# Altium schematic sheet AVALON_hashunit_chip.SchDoc
size A1
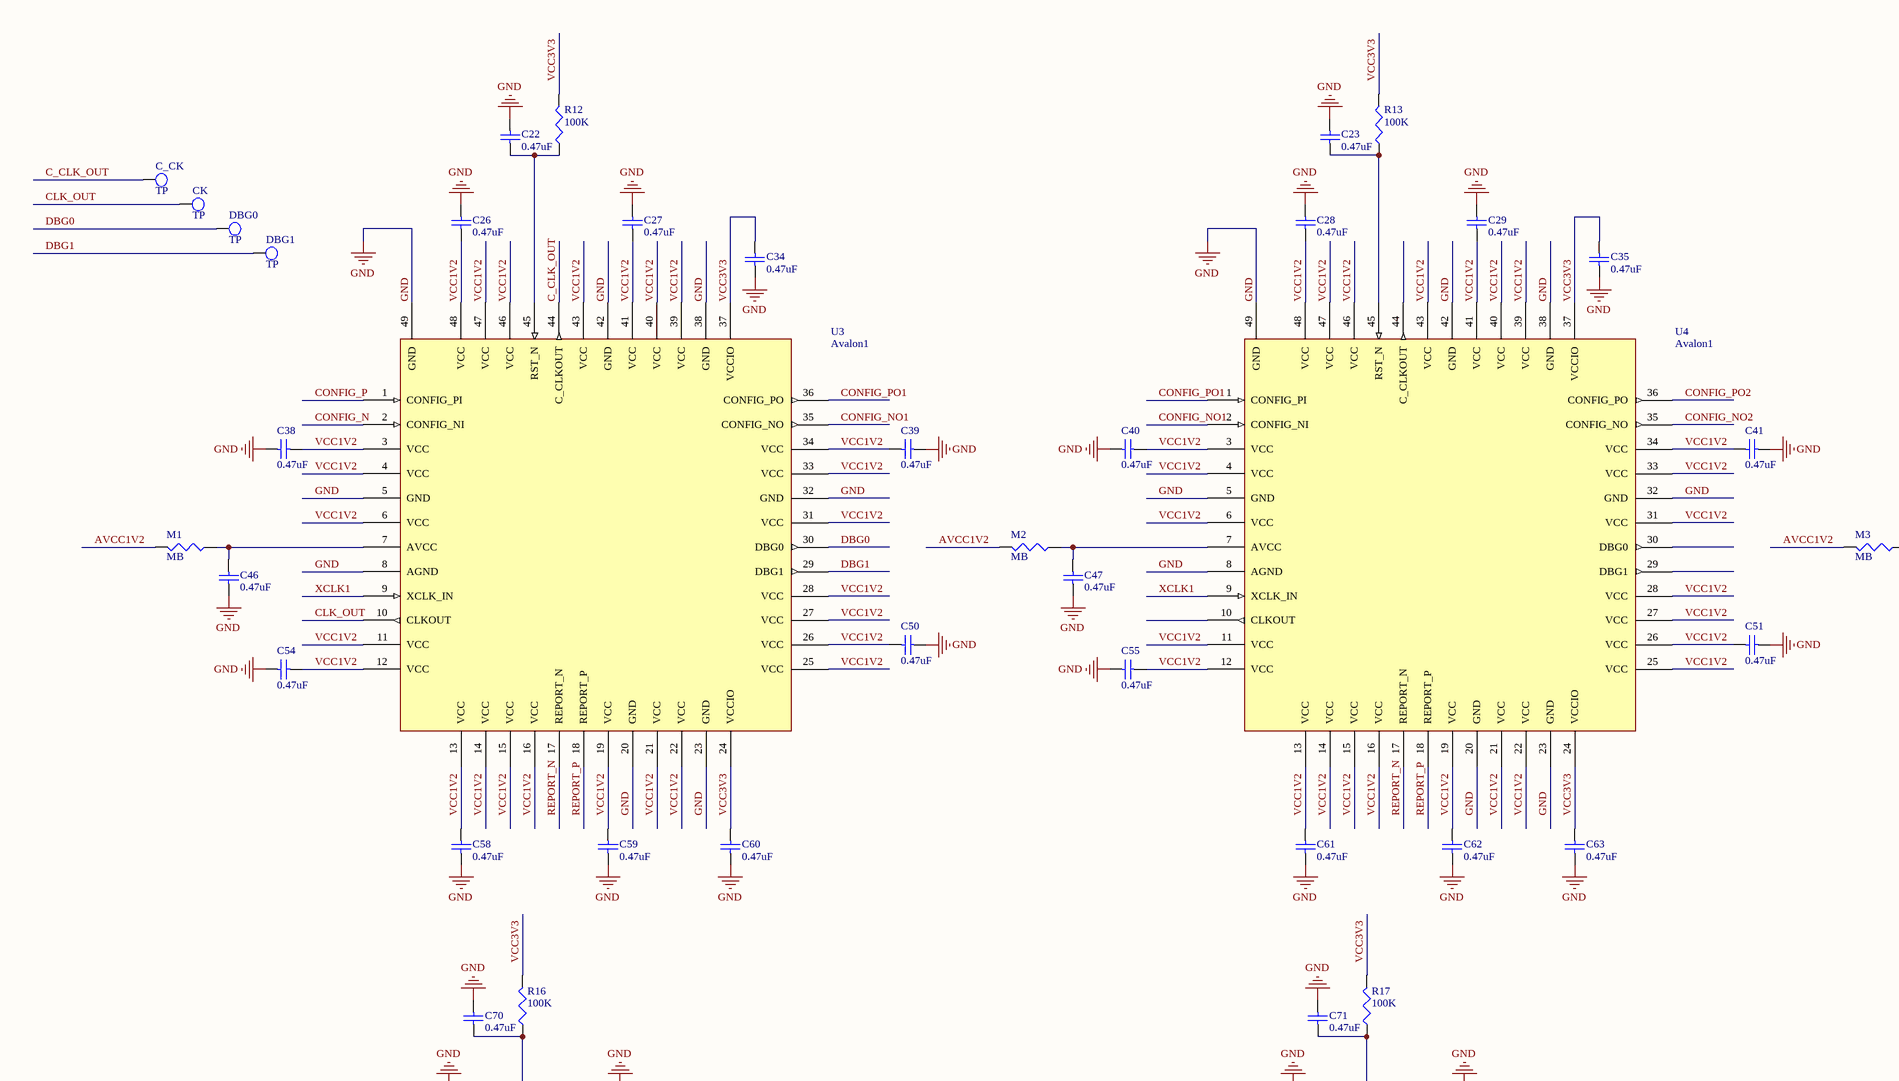
[diagram p0: AVALON_hashunit_chip.SchDoc, top left]
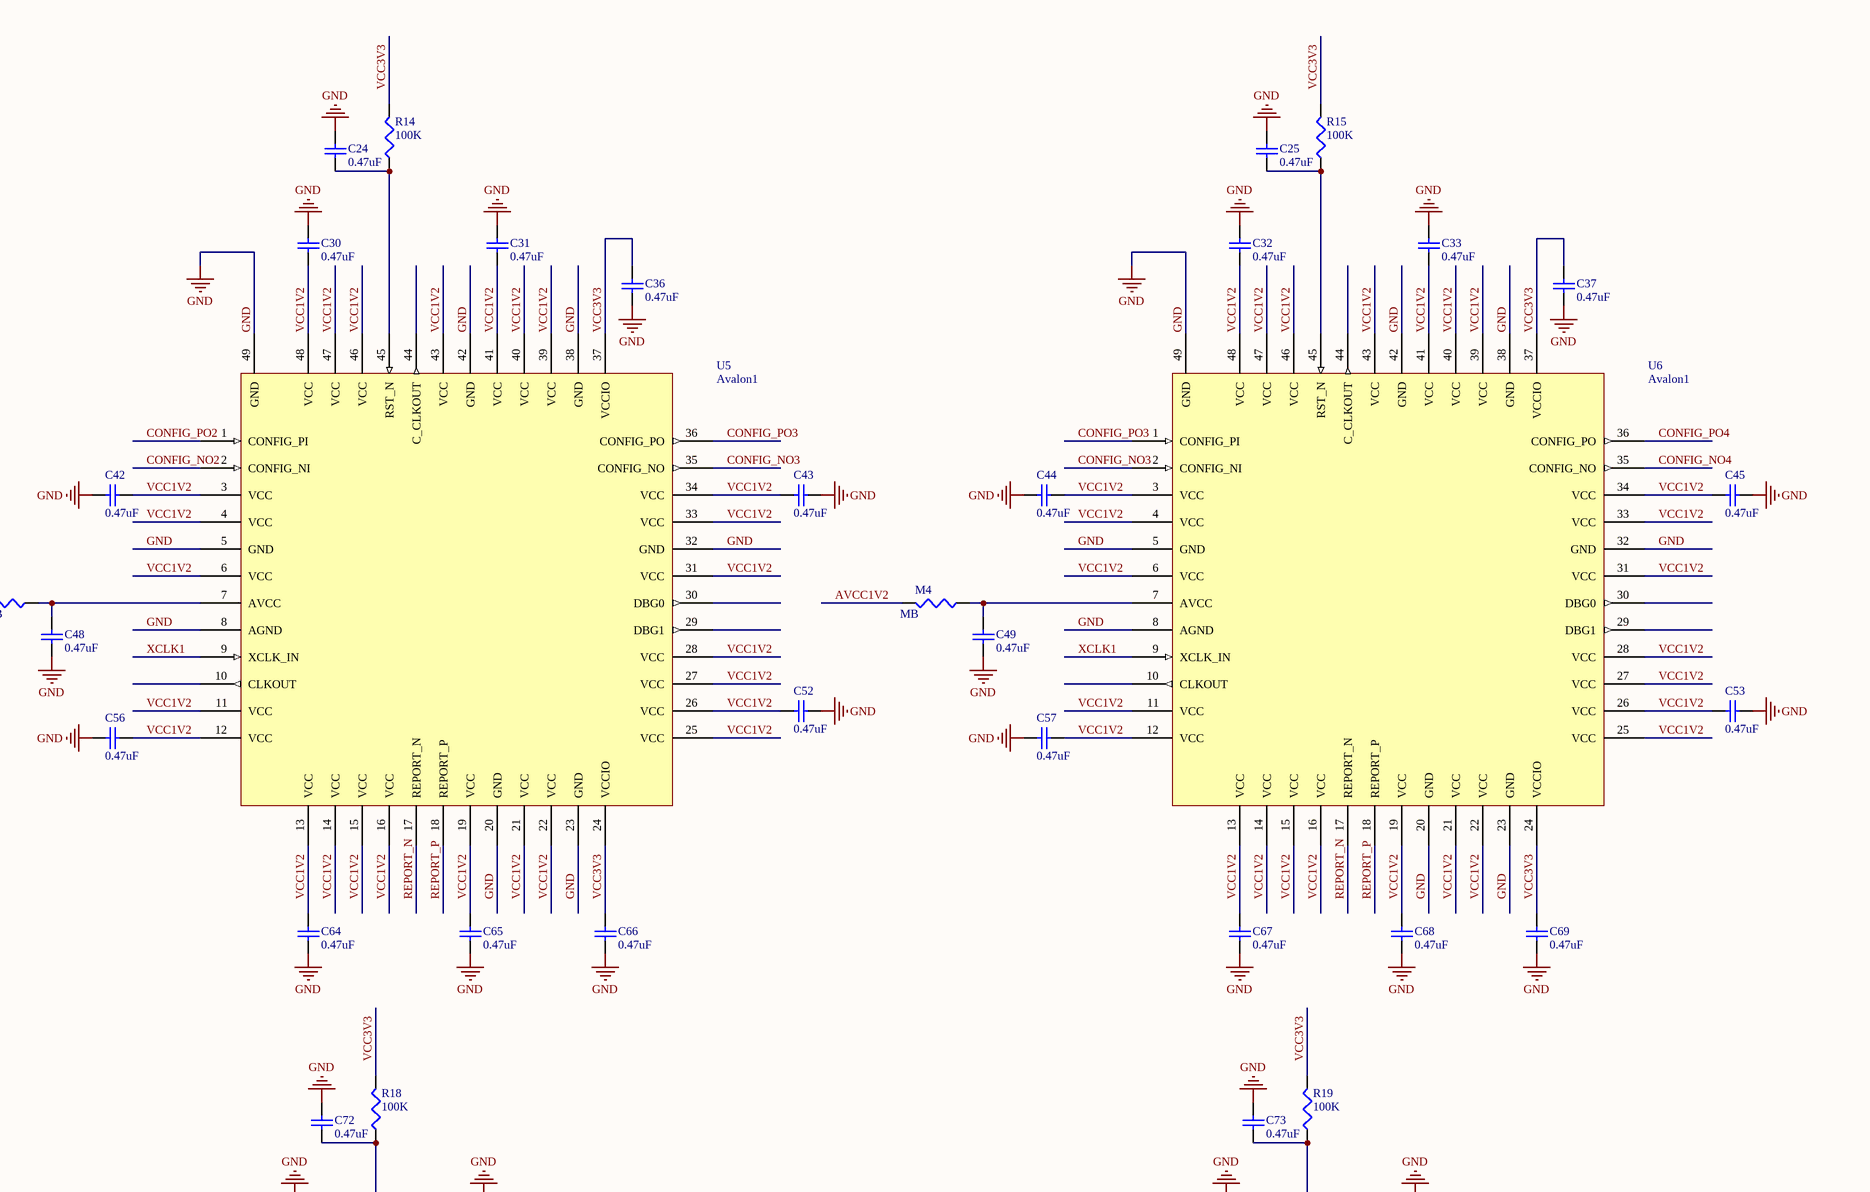
[diagram p1: AVALON_hashunit_chip.SchDoc, top right]
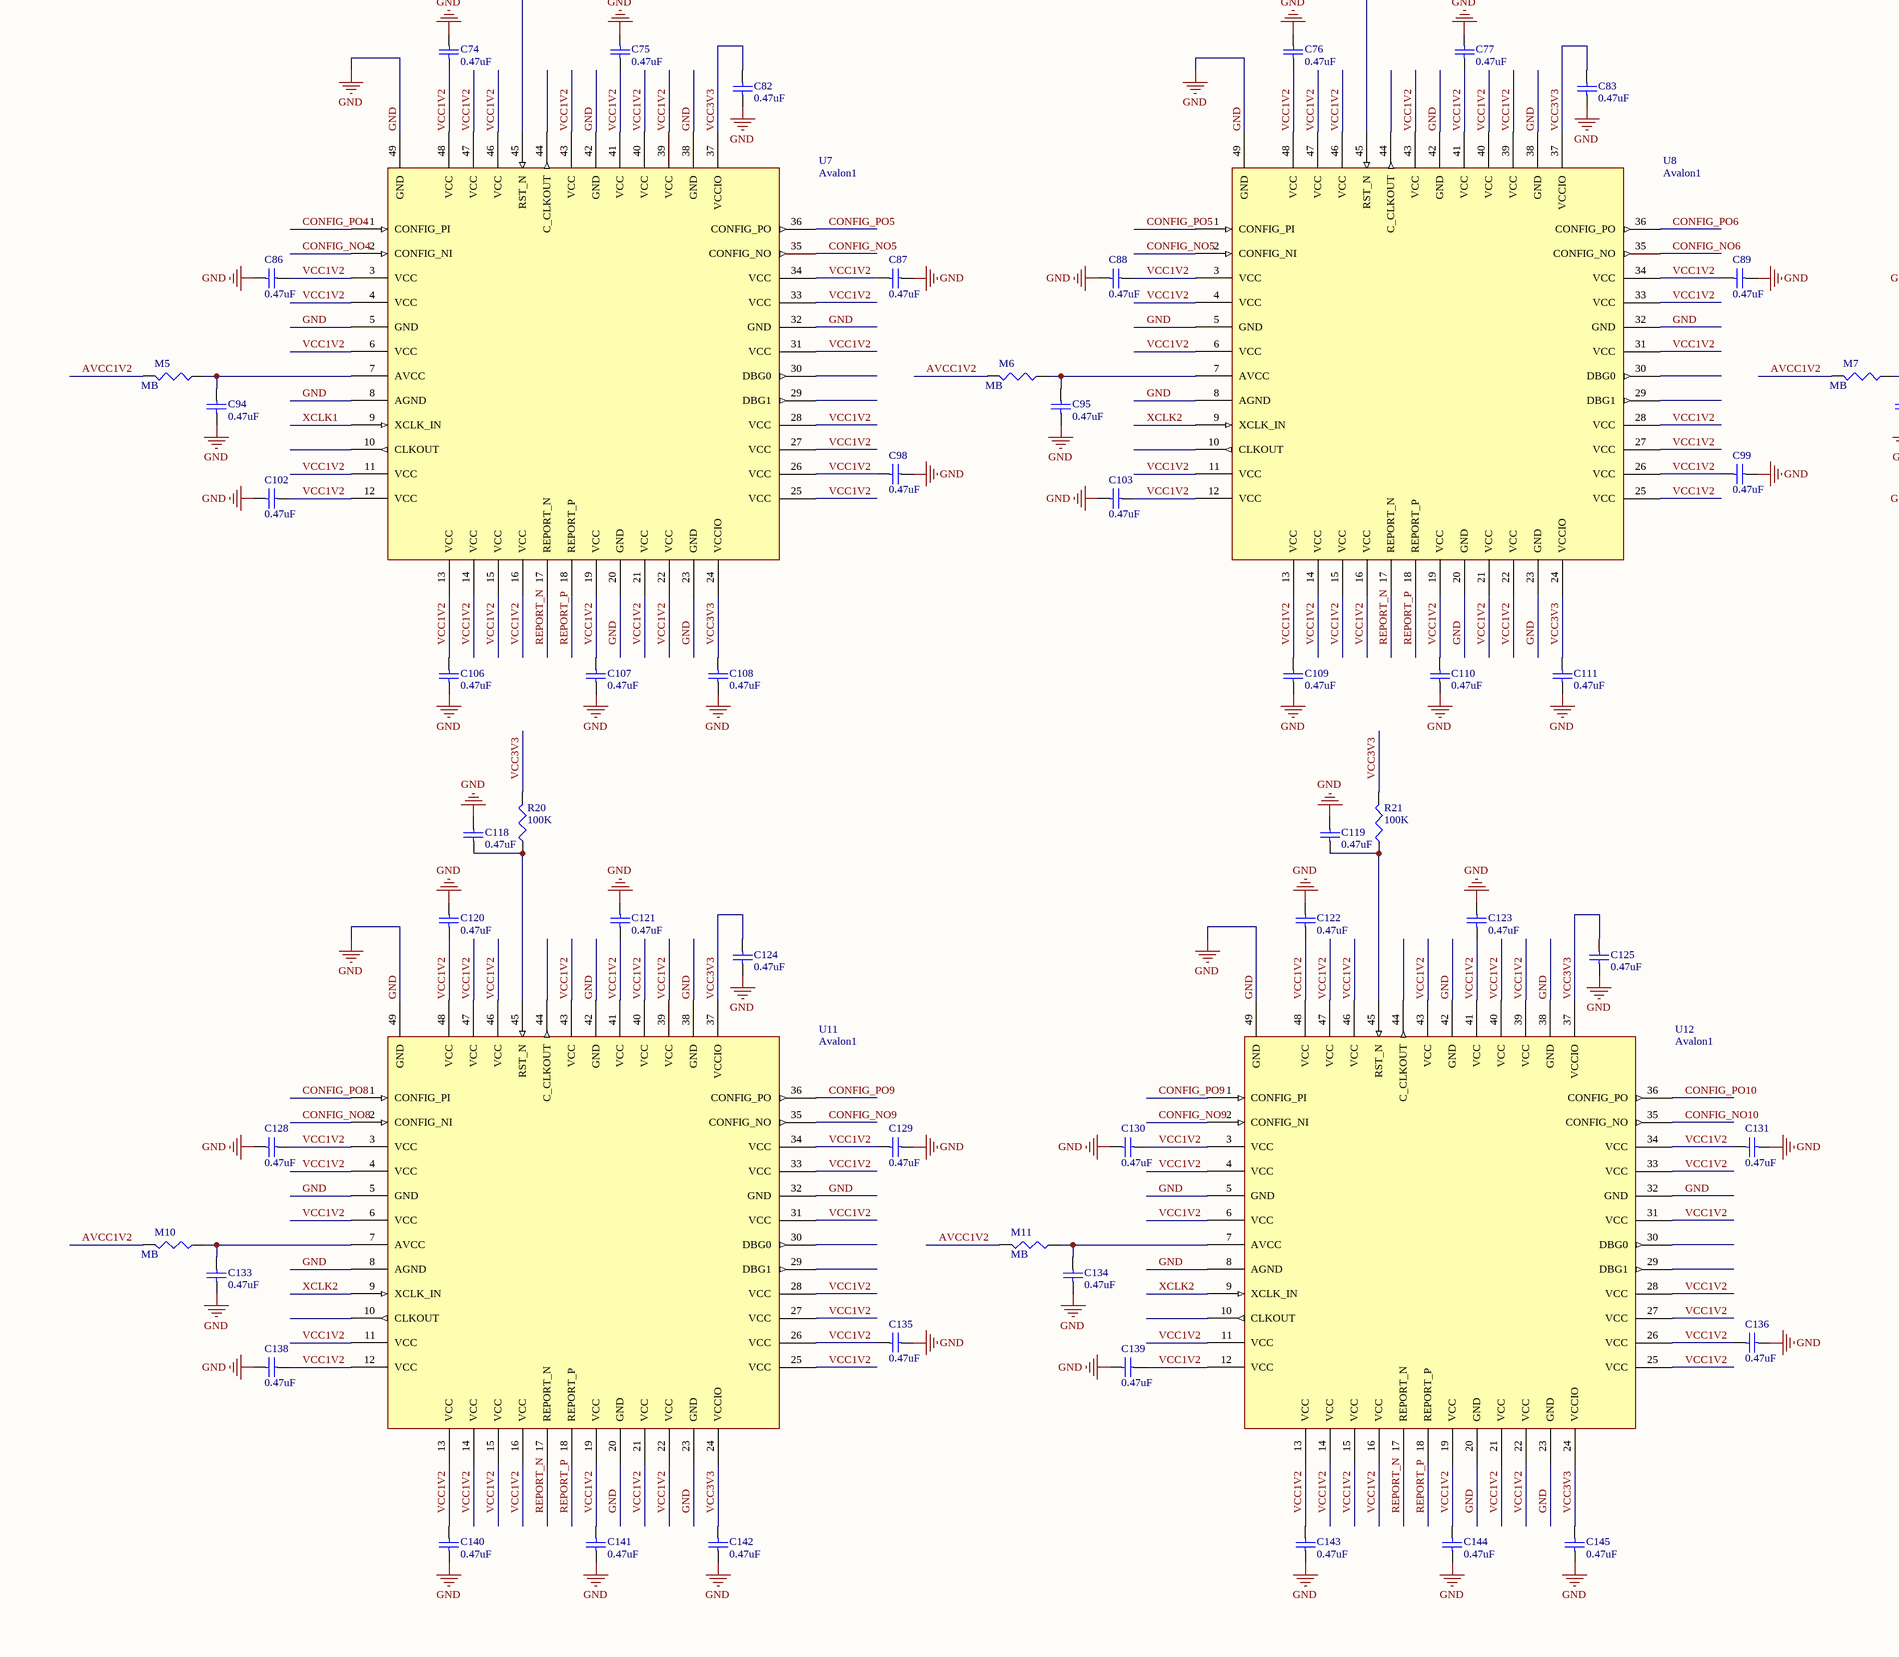
[diagram p2: AVALON_hashunit_chip.SchDoc, bottom left]
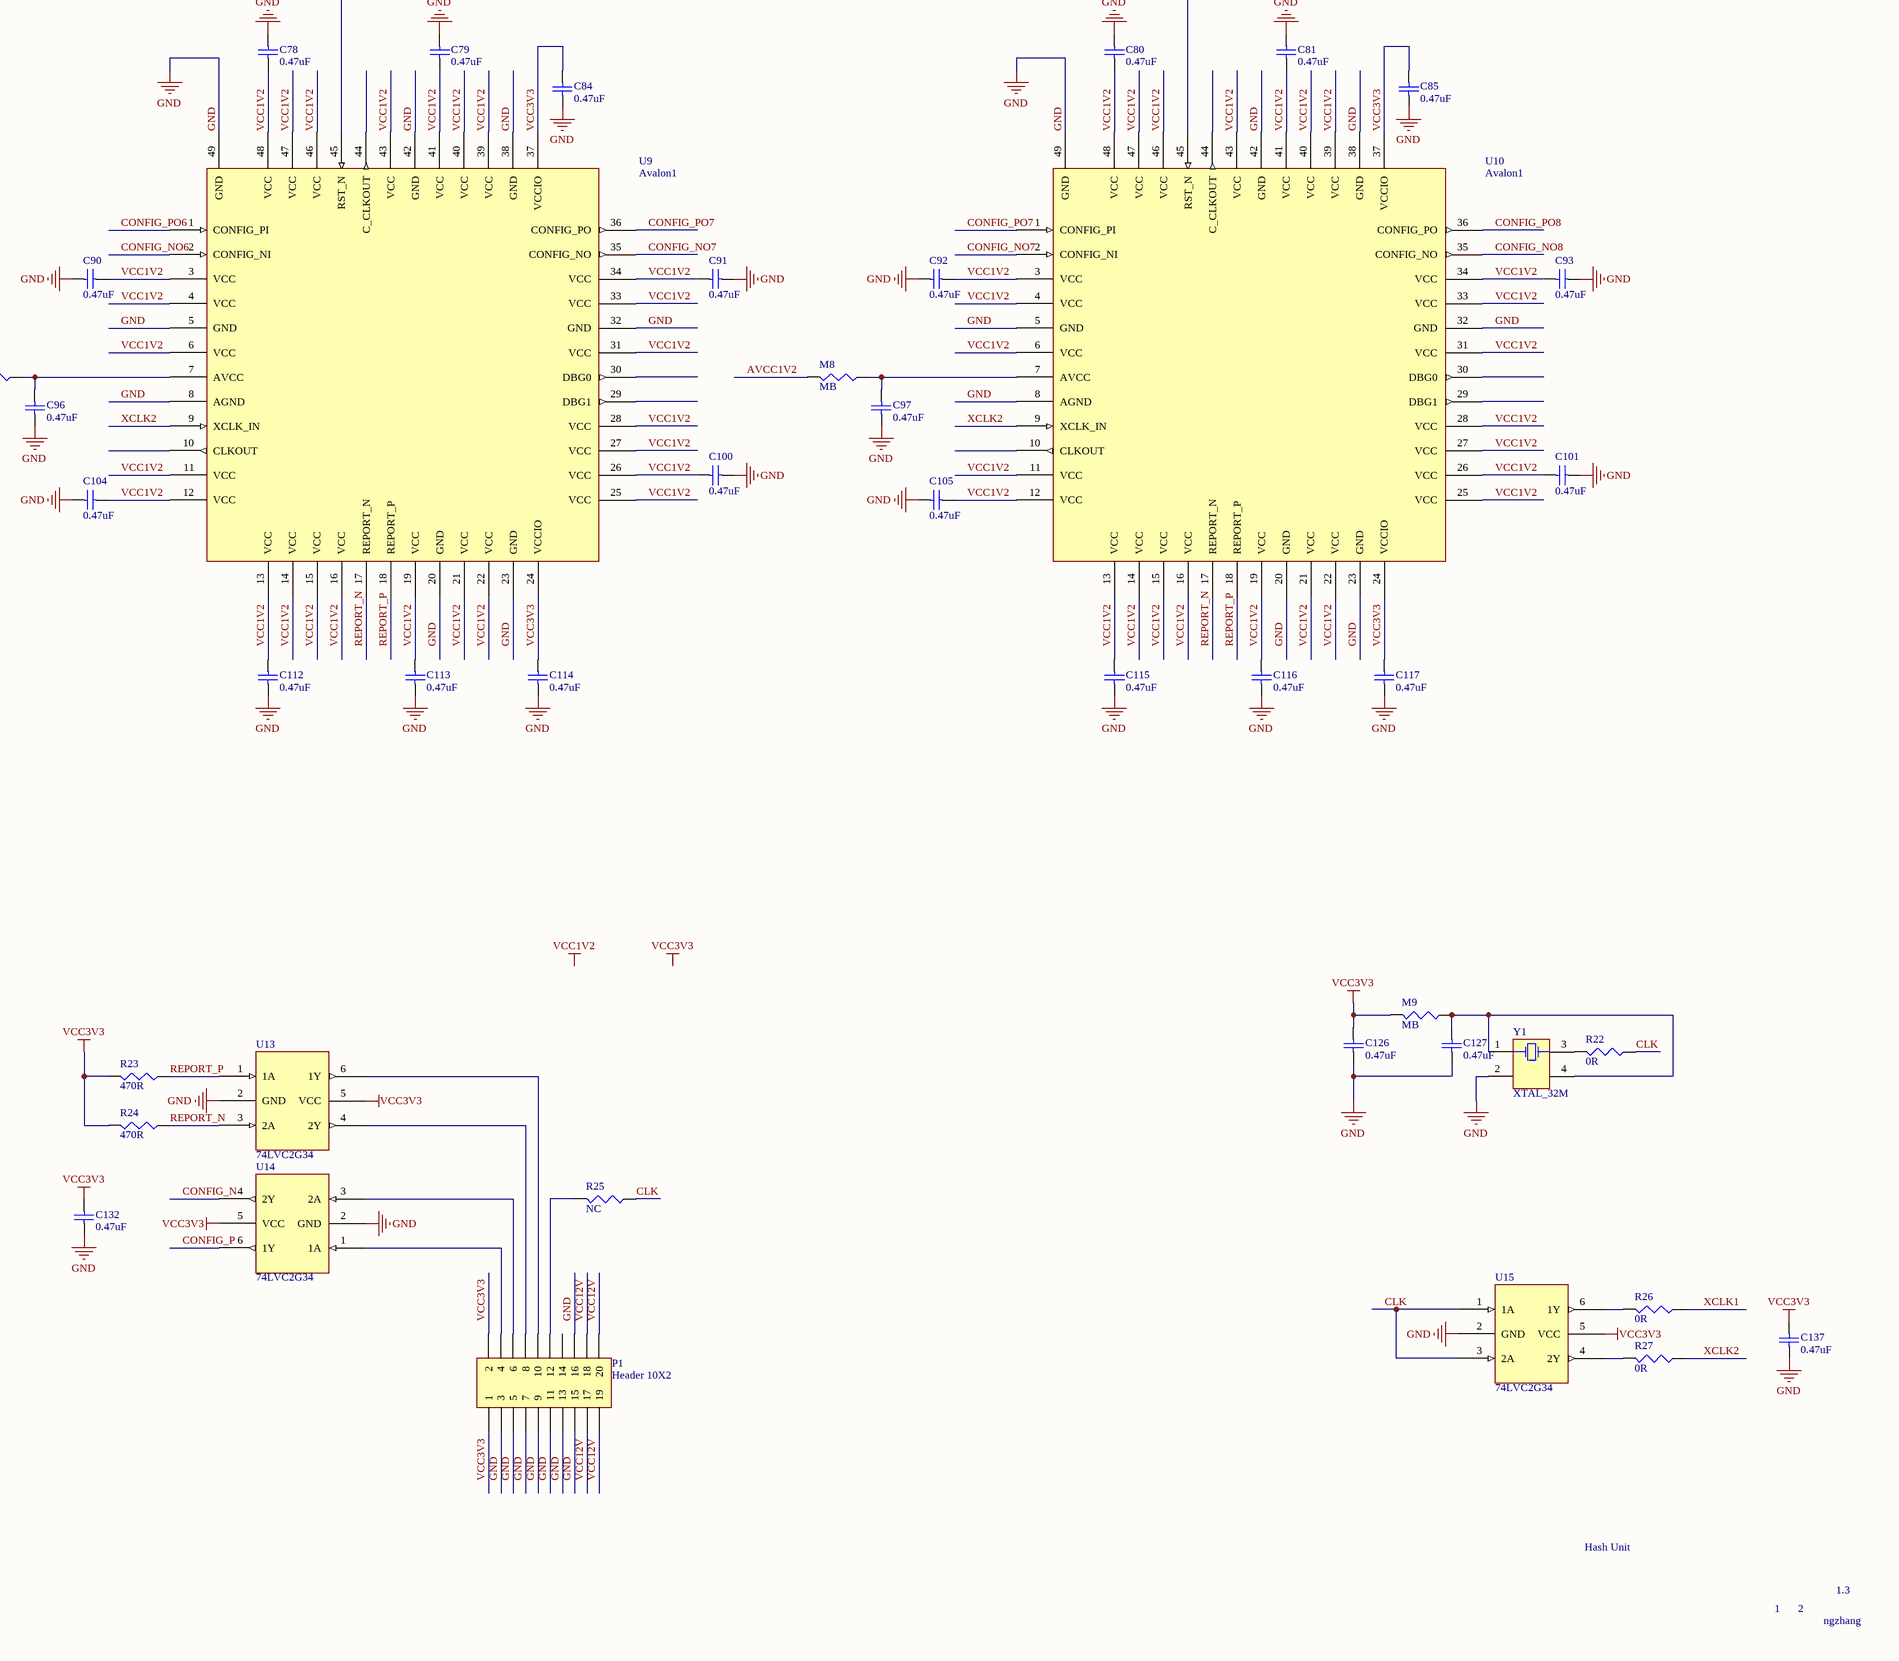
[diagram p3: AVALON_hashunit_chip.SchDoc, bottom right]

## Parts
C22  0.47uF  [CAPC1005L]
C23  0.47uF  [CAPC1005L]
C24  0.47uF  [CAPC1005L]
C25  0.47uF  [CAPC1005L]
C26  0.47uF  [CAPC1005L]
C27  0.47uF  [CAPC1005L]
C28  0.47uF  [CAPC1005L]
C29  0.47uF  [CAPC1005L]
C30  0.47uF  [CAPC1005L]
C31  0.47uF  [CAPC1005L]
C32  0.47uF  [CAPC1005L]
C33  0.47uF  [CAPC1005L]
C34  0.47uF  [CAPC1005L]
C35  0.47uF  [CAPC1005L]
C36  0.47uF  [CAPC1005L]
C37  0.47uF  [CAPC1005L]
C38  0.47uF  [CAPC1005L]
C39  0.47uF  [CAPC1005L]
C40  0.47uF  [CAPC1005L]
C41  0.47uF  [CAPC1005L]
C42  0.47uF  [CAPC1005L]
C43  0.47uF  [CAPC1005L]
C44  0.47uF  [CAPC1005L]
C45  0.47uF  [CAPC1005L]
C46  0.47uF  [CAPC1005L]
C47  0.47uF  [CAPC1005L]
C48  0.47uF  [CAPC1005L]
C49  0.47uF  [CAPC1005L]
C50  0.47uF  [CAPC1005L]
C51  0.47uF  [CAPC1005L]
C52  0.47uF  [CAPC1005L]
C53  0.47uF  [CAPC1005L]
C54  0.47uF  [CAPC1005L]
C55  0.47uF  [CAPC1005L]
C56  0.47uF  [CAPC1005L]
C57  0.47uF  [CAPC1005L]
C58  0.47uF  [CAPC1005L]
C59  0.47uF  [CAPC1005L]
C60  0.47uF  [CAPC1005L]
C61  0.47uF  [CAPC1005L]
C62  0.47uF  [CAPC1005L]
C63  0.47uF  [CAPC1005L]
C64  0.47uF  [CAPC1005L]
C65  0.47uF  [CAPC1005L]
C66  0.47uF  [CAPC1005L]
C67  0.47uF  [CAPC1005L]
C68  0.47uF  [CAPC1005L]
C69  0.47uF  [CAPC1005L]
C70  0.47uF  [CAPC1005L]
C71  0.47uF  [CAPC1005L]
C72  0.47uF  [CAPC1005L]
C73  0.47uF  [CAPC1005L]
C74  0.47uF  [CAPC1005L]
C75  0.47uF  [CAPC1005L]
C76  0.47uF  [CAPC1005L]
C77  0.47uF  [CAPC1005L]
C78  0.47uF  [CAPC1005L]
C79  0.47uF  [CAPC1005L]
C80  0.47uF  [CAPC1005L]
C81  0.47uF  [CAPC1005L]
C82  0.47uF  [CAPC1005L]
C83  0.47uF  [CAPC1005L]
C84  0.47uF  [CAPC1005L]
C85  0.47uF  [CAPC1005L]
C86  0.47uF  [CAPC1005L]
C87  0.47uF  [CAPC1005L]
C88  0.47uF  [CAPC1005L]
C89  0.47uF  [CAPC1005L]
C90  0.47uF  [CAPC1005L]
C91  0.47uF  [CAPC1005L]
C92  0.47uF  [CAPC1005L]
C93  0.47uF  [CAPC1005L]
C94  0.47uF  [CAPC1005L]
C95  0.47uF  [CAPC1005L]
C96  0.47uF  [CAPC1005L]
C97  0.47uF  [CAPC1005L]
C98  0.47uF  [CAPC1005L]
C99  0.47uF  [CAPC1005L]
C100  0.47uF  [CAPC1005L]
C101  0.47uF  [CAPC1005L]
C102  0.47uF  [CAPC1005L]
C103  0.47uF  [CAPC1005L]
C104  0.47uF  [CAPC1005L]
C105  0.47uF  [CAPC1005L]
C106  0.47uF  [CAPC1005L]
C107  0.47uF  [CAPC1005L]
C108  0.47uF  [CAPC1005L]
C109  0.47uF  [CAPC1005L]
C110  0.47uF  [CAPC1005L]
C111  0.47uF  [CAPC1005L]
C112  0.47uF  [CAPC1005L]
C113  0.47uF  [CAPC1005L]
C114  0.47uF  [CAPC1005L]
C115  0.47uF  [CAPC1005L]
C116  0.47uF  [CAPC1005L]
C117  0.47uF  [CAPC1005L]
C118  0.47uF  [CAPC1005L]
C119  0.47uF  [CAPC1005L]
C120  0.47uF  [CAPC1005L]
C121  0.47uF  [CAPC1005L]
C122  0.47uF  [CAPC1005L]
C123  0.47uF  [CAPC1005L]
C124  0.47uF  [CAPC1005L]
C125  0.47uF  [CAPC1005L]
C126  0.47uF  [CAPC1005L]
C127  0.47uF  [CAPC1005L]
C128  0.47uF  [CAPC1005L]
C129  0.47uF  [CAPC1005L]
C130  0.47uF  [CAPC1005L]
C131  0.47uF  [CAPC1005L]
C132  0.47uF  [CAPC1005L]
C133  0.47uF  [CAPC1005L]
C134  0.47uF  [CAPC1005L]
C135  0.47uF  [CAPC1005L]
C136  0.47uF  [CAPC1005L]
C137  0.47uF  [CAPC1005L]
C138  0.47uF  [CAPC1005L]
C139  0.47uF  [CAPC1005L]
C140  0.47uF  [CAPC1005L]
C141  0.47uF  [CAPC1005L]
C142  0.47uF  [CAPC1005L]
C143  0.47uF  [CAPC1005L]
C144  0.47uF  [CAPC1005L]
C145  0.47uF  [CAPC1005L]
C_CK  TP  [TP]
CK  TP  [TP]
DBG0  TP  [TP]
DBG1  TP  [TP]
M1  MB  [RESC1005L]
M2  MB  [RESC1005L]
M3  MB  [RESC1005L]
M4  MB  [RESC1005L]
M5  MB  [RESC1005L]
M6  MB  [RESC1005L]
M7  MB  [RESC1005L]
M8  MB  [RESC1005L]
M9  MB  [RESC1005L]
M10  MB  [RESC1005L]
M11  MB  [RESC1005L]
P1  Header 10X2  [20PINSMT]
R12  100K  [RESC1005L]
R13  100K  [RESC1005L]
R14  100K  [RESC1005L]
R15  100K  [RESC1005L]
R16  100K  [RESC1005L]
R17  100K  [RESC1005L]
R18  100K  [RESC1005L]
R19  100K  [RESC1005L]
R20  100K  [RESC1005L]
R21  100K  [RESC1005L]
R22  0R  [RESC1005L]
R23  470R  [RESC1005L]
R24  470R  [RESC1005L]
R25  NC  [RESC1005L]
R26  0R  [RESC1005L]
R27  0R  [RESC1005L]
U3  Avalon1  [QFN48NT7A]
U4  Avalon1  [QFN48NT7A]
U5  Avalon1  [QFN48NT7A]
U6  Avalon1  [QFN48NT7A]
U7  Avalon1  [QFN48NT7A]
U8  Avalon1  [QFN48NT7A]
U9  Avalon1  [QFN48NT7A]
U10  Avalon1  [QFN48NT7A]
U11  Avalon1  [QFN48NT7A]
U12  Avalon1  [QFN48NT7A]
U13  74LVC2G34  [SOT363_L]
U14  74LVC2G34  [SOT363_L]
U15  74LVC2G34  [SOT363_L]
Y1  XTAL_32M  [SMX2]

## Nets
GND: C22.2 C23.2 C24.2 C25.2 C26.2 C27.1 C28.2 C29.1 C30.2 C31.1 C32.2 C33.1 C34.1 C35.1 C36.1 C37.1 C38.2 C39.1 C40.2 C41.1 C42.2 C43.1 C44.2 C45.1 C46.2 C47.2 C48.2 C49.2 C50.1 C51.1 C52.1 C53.1 C54.2 C55.2 C56.2 C57.2 C58.1 C59.1 C60.1 C61.1 C62.1 C63.1 C64.1 C65.1 C66.1 C67.1 C68.1 C69.1 C70.2 C71.2 C72.2 C73.2 C74.2 C75.1 C76.2 C77.1 C78.2 C79.1 C80.2 C81.1 C82.1 C83.1 C84.1 C85.1 C86.2 C87.1 C88.2 C89.1 C90.2 C91.1 C92.2 C93.1 C94.2 C95.2 C96.2 C97.2 C98.1 C99.1 C100.1 C101.1 C102.2 C103.2 C104.2 C105.2 C106.1 C107.1 C108.1 C109.1 C110.1 C111.1 C112.1 C113.1 C114.1 C115.1 C116.1 C117.1 C118.2 C119.2 C120.2 C121.1 C122.2 C123.1 C124.1 C125.1 C126.1 C127.1 C128.2 C129.1 C130.2 C131.1 C132.2 C133.2 C134.2 C135.1 C136.1 C137.2 C138.2 C139.2 C140.1 C141.1 C142.1 C143.1 C144.1 C145.1 P1.3 P1.5 P1.7 P1.9 P1.11 P1.13 P1.15 P1.16 U3.5(GND) U3.8(AGND) U3.20(GND) U3.23(GND) U3.32(GND) U3.38(GND) U3.42(GND) U3.49(GND) U4.5(GND) U4.8(AGND) U4.20(GND) U4.23(GND) U4.32(GND) U4.38(GND) U4.42(GND) U4.49(GND) U5.5(GND) U5.8(AGND) U5.20(GND) U5.23(GND) U5.32(GND) U5.38(GND) U5.42(GND) U5.49(GND) U6.5(GND) U6.8(AGND) U6.20(GND) U6.23(GND) U6.32(GND) U6.38(GND) U6.42(GND) U6.49(GND) U7.5(GND) U7.8(AGND) U7.20(GND) U7.23(GND) U7.32(GND) U7.38(GND) U7.42(GND) U7.49(GND) U8.5(GND) U8.8(AGND) U8.20(GND) U8.23(GND) U8.32(GND) U8.38(GND) U8.42(GND) U8.49(GND) U9.5(GND) U9.8(AGND) U9.20(GND) U9.23(GND) U9.32(GND) U9.38(GND) U9.42(GND) U9.49(GND) U10.5(GND) U10.8(AGND) U10.20(GND) U10.23(GND) U10.32(GND) U10.38(GND) U10.42(GND) U10.49(GND) U11.5(GND) U11.8(AGND) U11.20(GND) U11.23(GND) U11.32(GND) U11.38(GND) U11.42(GND) U11.49(GND) U12.5(GND) U12.8(AGND) U12.20(GND) U12.23(GND) U12.32(GND) U12.38(GND) U12.42(GND) U12.49(GND) U13.2(GND) U14.2(GND) U15.2(GND) Y1.2(NC)
VCC1V2: C26.1 C27.2 C28.1 C29.2 C30.1 C31.2 C32.1 C33.2 C38.1 C39.2 C40.1 C41.2 C42.1 C43.2 C44.1 C45.2 C50.2 C51.2 C52.2 C53.2 C54.1 C55.1 C56.1 C57.1 C58.2 C59.2 C61.2 C62.2 C64.2 C65.2 C67.2 C68.2 C74.1 C75.2 C76.1 C77.2 C78.1 C79.2 C80.1 C81.2 C86.1 C87.2 C88.1 C89.2 C90.1 C91.2 C92.1 C93.2 C98.2 C99.2 C100.2 C101.2 C102.1 C103.1 C104.1 C105.1 C106.2 C107.2 C109.2 C110.2 C112.2 C113.2 C115.2 C116.2 C120.1 C121.2 C122.1 C123.2 C128.1 C129.2 C130.1 C131.2 C135.2 C136.2 C138.1 C139.1 C140.2 C141.2 C143.2 C144.2 U3.3(VCC) U3.4(VCC) U3.6(VCC) U3.11(VCC) U3.12(VCC) U3.13(VCC) U3.14(VCC) U3.15(VCC) U3.16(VCC) U3.19(VCC) U3.21(VCC) U3.22(VCC) U3.25(VCC) U3.26(VCC) U3.27(VCC) U3.28(VCC) U3.31(VCC) U3.33(VCC) U3.34(VCC) U3.39(VCC) U3.40(VCC) U3.41(VCC) U3.43(VCC) U3.46(VCC) U3.47(VCC) U3.48(VCC) U4.3(VCC) U4.4(VCC) U4.6(VCC) U4.11(VCC) U4.12(VCC) U4.13(VCC) U4.14(VCC) U4.15(VCC) U4.16(VCC) U4.19(VCC) U4.21(VCC) U4.22(VCC) U4.25(VCC) U4.26(VCC) U4.27(VCC) U4.28(VCC) U4.31(VCC) U4.33(VCC) U4.34(VCC) U4.39(VCC) U4.40(VCC) U4.41(VCC) U4.43(VCC) U4.46(VCC) U4.47(VCC) U4.48(VCC) U5.3(VCC) U5.4(VCC) U5.6(VCC) U5.11(VCC) U5.12(VCC) U5.13(VCC) U5.14(VCC) U5.15(VCC) U5.16(VCC) U5.19(VCC) U5.21(VCC) U5.22(VCC) U5.25(VCC) U5.26(VCC) U5.27(VCC) U5.28(VCC) U5.31(VCC) U5.33(VCC) U5.34(VCC) U5.39(VCC) U5.40(VCC) U5.41(VCC) U5.43(VCC) U5.46(VCC) U5.47(VCC) U5.48(VCC) U6.3(VCC) U6.4(VCC) U6.6(VCC) U6.11(VCC) U6.12(VCC) U6.13(VCC) U6.14(VCC) U6.15(VCC) U6.16(VCC) U6.19(VCC) U6.21(VCC) U6.22(VCC) U6.25(VCC) U6.26(VCC) U6.27(VCC) U6.28(VCC) U6.31(VCC) U6.33(VCC) U6.34(VCC) U6.39(VCC) U6.40(VCC) U6.41(VCC) U6.43(VCC) U6.46(VCC) U6.47(VCC) U6.48(VCC) U7.3(VCC) U7.4(VCC) U7.6(VCC) U7.11(VCC) U7.12(VCC) U7.13(VCC) U7.14(VCC) U7.15(VCC) U7.16(VCC) U7.19(VCC) U7.21(VCC) U7.22(VCC) U7.25(VCC) U7.26(VCC) U7.27(VCC) U7.28(VCC) U7.31(VCC) U7.33(VCC) U7.34(VCC) U7.39(VCC) U7.40(VCC) U7.41(VCC) U7.43(VCC) U7.46(VCC) U7.47(VCC) U7.48(VCC) U8.3(VCC) U8.4(VCC) U8.6(VCC) U8.11(VCC) U8.12(VCC) U8.13(VCC) U8.14(VCC) U8.15(VCC) U8.16(VCC) U8.19(VCC) U8.21(VCC) U8.22(VCC) U8.25(VCC) U8.26(VCC) U8.27(VCC) U8.28(VCC) U8.31(VCC) U8.33(VCC) U8.34(VCC) U8.39(VCC) U8.40(VCC) U8.41(VCC) U8.43(VCC) U8.46(VCC) U8.47(VCC) U8.48(VCC) U9.3(VCC) U9.4(VCC) U9.6(VCC) U9.11(VCC) U9.12(VCC) U9.13(VCC) U9.14(VCC) U9.15(VCC) U9.16(VCC) U9.19(VCC) U9.21(VCC) U9.22(VCC) U9.25(VCC) U9.26(VCC) U9.27(VCC) U9.28(VCC) U9.31(VCC) U9.33(VCC) U9.34(VCC) U9.39(VCC) U9.40(VCC) U9.41(VCC) U9.43(VCC) U9.46(VCC) U9.47(VCC) U9.48(VCC) U10.3(VCC) U10.4(VCC) U10.6(VCC) U10.11(VCC) U10.12(VCC) U10.13(VCC) U10.14(VCC) U10.15(VCC) U10.16(VCC) U10.19(VCC) U10.21(VCC) U10.22(VCC) U10.25(VCC) U10.26(VCC) U10.27(VCC) U10.28(VCC) U10.31(VCC) U10.33(VCC) U10.34(VCC) U10.39(VCC) U10.40(VCC) U10.41(VCC) U10.43(VCC) U10.46(VCC) U10.47(VCC) U10.48(VCC) U11.3(VCC) U11.4(VCC) U11.6(VCC) U11.11(VCC) U11.12(VCC) U11.13(VCC) U11.14(VCC) U11.15(VCC) U11.16(VCC) U11.19(VCC) U11.21(VCC) U11.22(VCC) U11.25(VCC) U11.26(VCC) U11.27(VCC) U11.28(VCC) U11.31(VCC) U11.33(VCC) U11.34(VCC) U11.39(VCC) U11.40(VCC) U11.41(VCC) U11.43(VCC) U11.46(VCC) U11.47(VCC) U11.48(VCC) U12.3(VCC) U12.4(VCC) U12.6(VCC) U12.11(VCC) U12.12(VCC) U12.13(VCC) U12.14(VCC) U12.15(VCC) U12.16(VCC) U12.19(VCC) U12.21(VCC) U12.22(VCC) U12.25(VCC) U12.26(VCC) U12.27(VCC) U12.28(VCC) U12.31(VCC) U12.33(VCC) U12.34(VCC) U12.39(VCC) U12.40(VCC) U12.41(VCC) U12.43(VCC) U12.46(VCC) U12.47(VCC) U12.48(VCC)
VCC3V3: C34.2 C35.2 C36.2 C37.2 C60.2 C63.2 C66.2 C69.2 C82.2 C83.2 C84.2 C85.2 C108.2 C111.2 C114.2 C117.2 C124.2 C125.2 C126.2 C132.1 C137.1 C142.2 C145.2 M9.2 P1.1 P1.2 R12.2 R13.2 R14.2 R15.2 R16.2 R17.2 R18.2 R19.2 R20.2 R21.2 R23.2 R24.2 U3.24(VCCIO) U3.37(VCCIO) U4.24(VCCIO) U4.37(VCCIO) U5.24(VCCIO) U5.37(VCCIO) U6.24(VCCIO) U6.37(VCCIO) U7.24(VCCIO) U7.37(VCCIO) U8.24(VCCIO) U8.37(VCCIO) U9.24(VCCIO) U9.37(VCCIO) U10.24(VCCIO) U10.37(VCCIO) U11.24(VCCIO) U11.37(VCCIO) U12.24(VCCIO) U12.37(VCCIO) U13.5(VCC) U14.5(VCC) U15.5(VCC)
AVCC1V2: M1.2 M2.2 M3.2 M4.2 M5.2 M6.2 M7.2 M8.2 M10.2 M11.2
C_CLK_OUT: C_CK.1(TP) U3.44(C_CLKOUT)
CLK: R22.1 R25.1 U15.1(1A) U15.3(2A)
CLK_OUT: CK.1(TP) U3.10(CLKOUT)
CONFIG_N: U3.2(CONFIG_NI) U14.4(2Y)
CONFIG_NO1: U3.35(CONFIG_NO) U4.2(CONFIG_NI)
CONFIG_NO2: U4.35(CONFIG_NO) U5.2(CONFIG_NI)
CONFIG_NO3: U5.35(CONFIG_NO) U6.2(CONFIG_NI)
CONFIG_NO4: U6.35(CONFIG_NO) U7.2(CONFIG_NI)
CONFIG_NO5: U7.35(CONFIG_NO) U8.2(CONFIG_NI)
CONFIG_NO6: U8.35(CONFIG_NO) U9.2(CONFIG_NI)
CONFIG_NO7: U9.35(CONFIG_NO) U10.2(CONFIG_NI)
CONFIG_NO8: U10.35(CONFIG_NO) U11.2(CONFIG_NI)
CONFIG_NO9: U11.35(CONFIG_NO) U12.2(CONFIG_NI)
CONFIG_NO10: U12.35(CONFIG_NO)
CONFIG_P: U3.1(CONFIG_PI) U14.6(1Y)
CONFIG_PO1: U3.36(CONFIG_PO) U4.1(CONFIG_PI)
CONFIG_PO2: U4.36(CONFIG_PO) U5.1(CONFIG_PI)
CONFIG_PO3: U5.36(CONFIG_PO) U6.1(CONFIG_PI)
CONFIG_PO4: U6.36(CONFIG_PO) U7.1(CONFIG_PI)
CONFIG_PO5: U7.36(CONFIG_PO) U8.1(CONFIG_PI)
CONFIG_PO6: U8.36(CONFIG_PO) U9.1(CONFIG_PI)
CONFIG_PO7: U9.36(CONFIG_PO) U10.1(CONFIG_PI)
CONFIG_PO8: U10.36(CONFIG_PO) U11.1(CONFIG_PI)
CONFIG_PO9: U11.36(CONFIG_PO) U12.1(CONFIG_PI)
CONFIG_PO10: U12.36(CONFIG_PO)
DBG0: DBG0.1(TP) U3.30(DBG0)
DBG1: DBG1.1(TP) U3.29(DBG1)
REPORT_N: R24.1 U3.17(REPORT_N) U4.17(REPORT_N) U5.17(REPORT_N) U6.17(REPORT_N) U7.17(REPORT_N) U8.17(REPORT_N) U9.17(REPORT_N) U10.17(REPORT_N) U11.17(REPORT_N) U12.17(REPORT_N) U13.3(2A)
REPORT_P: R23.1 U3.18(REPORT_P) U4.18(REPORT_P) U5.18(REPORT_P) U6.18(REPORT_P) U7.18(REPORT_P) U8.18(REPORT_P) U9.18(REPORT_P) U10.18(REPORT_P) U11.18(REPORT_P) U12.18(REPORT_P) U13.1(1A)
VCC12V: P1.17 P1.18 P1.19 P1.20
XCLK1: R26.1 U3.9(XCLK_IN) U4.9(XCLK_IN) U5.9(XCLK_IN) U6.9(XCLK_IN) U7.9(XCLK_IN)
XCLK2: R27.1 U8.9(XCLK_IN) U9.9(XCLK_IN) U10.9(XCLK_IN) U11.9(XCLK_IN) U12.9(XCLK_IN)
NetC22_1: C22.1 R12.1 U3.45(RST_N)
NetC23_1: C23.1 R13.1 U4.45(RST_N)
NetC24_1: C24.1 R14.1 U5.45(RST_N)
NetC25_1: C25.1 R15.1 U6.45(RST_N)
NetC46_1: C46.1 M1.1 U3.7(AVCC)
NetC47_1: C47.1 M2.1 U4.7(AVCC)
NetC48_1: C48.1 M3.1 U5.7(AVCC)
NetC49_1: C49.1 M4.1 U6.7(AVCC)
NetC70_1: C70.1 R16.1 U7.45(RST_N)
NetC71_1: C71.1 R17.1 U8.45(RST_N)
NetC72_1: C72.1 R18.1 U9.45(RST_N)
NetC73_1: C73.1 R19.1 U10.45(RST_N)
NetC94_1: C94.1 M5.1 U7.7(AVCC)
NetC95_1: C95.1 M6.1 U8.7(AVCC)
NetC96_1: C96.1 M7.1 U9.7(AVCC)
NetC97_1: C97.1 M8.1 U10.7(AVCC)
NetC118_1: C118.1 R20.1 U11.45(RST_N)
NetC119_1: C119.1 R21.1 U12.45(RST_N)
NetC127_2: C127.2 M9.1 Y1.1(OSC1) Y1.4(NC)
NetC133_1: C133.1 M10.1 U11.7(AVCC)
NetC134_1: C134.1 M11.1 U12.7(AVCC)
NetP1_4: P1.4 U14.1(1A)
NetP1_6: P1.6 U14.3(2A)
NetP1_8: P1.8 U13.4(2Y)
NetP1_10: P1.10 U13.6(1Y)
NetP1_12: P1.12 R25.2
NetR22_2: R22.2 Y1.3(OSC2)
NetR26_2: R26.2 U15.6(1Y)
NetR27_2: R27.2 U15.4(2Y)

Not connected (* = marked no-connect by the designer): P1 14; U4 10(CLKOUT) 29(DBG1) 30(DBG0) 44(C_CLKOUT); U5 10(CLKOUT) 29(DBG1) 30(DBG0) 44(C_CLKOUT); U6 10(CLKOUT) 29(DBG1) 30(DBG0) 44(C_CLKOUT); U7 10(CLKOUT) 29(DBG1) 30(DBG0) 44(C_CLKOUT); U8 10(CLKOUT) 29(DBG1) 30(DBG0) 44(C_CLKOUT); U9 10(CLKOUT) 29(DBG1) 30(DBG0) 44(C_CLKOUT); U10 10(CLKOUT) 29(DBG1) 30(DBG0) 44(C_CLKOUT); U11 10(CLKOUT) 29(DBG1) 30(DBG0) 44(C_CLKOUT); U12 10(CLKOUT) 29(DBG1) 30(DBG0) 44(C_CLKOUT)

## Notes on the sheet
- Hash Unit
- 1      2
- ngzhang
- 1.3
- Labels drawn without touching a wire or pin: VCC1V2, VCC3V3

## Library data of the parts
C22-C145 = Cap Semi: Capacitor (Semiconductor SIM Model); Published: 8-Jun-2000; LatestRevisionDate: 29-May-2009; LatestRevisionNote: IPC-7351 Footprint Added.; PackageReference: C1206; Publisher: Altium Limited; PackageDescription: Chip Capacitor; Value: 0.47uF
M1-M11 = Res3: Published: 8-Jun-2000; LatestRevisionDate: 29-May-2009; LatestRevisionNote: IPC-7351 Footprint Added.; PackageReference: J1-0603; Publisher: Altium Limited; PackageDescription: Chip Resistor; Value: MB
P1 = Header 10X2: Header, 10-Pin, Dual row; LatestRevisionDate: 17-Jul-2002; LatestRevisionNote: Re-released for DXP Platform.; Publisher: Altium Limited
R12-R27 = Res3: Resistor; Published: 8-Jun-2000; LatestRevisionDate: 29-May-2009; LatestRevisionNote: IPC-7351 Footprint Added.; PackageReference: J1-0603; Publisher: Altium Limited; PackageDescription: Chip Resistor
  R12-R21: Value: 100K
  R22 R26 R27: Value: 0R
  R23 R24: Value: 470R
  R25: Value: NC
Y1 = 2SMX: Surface Mount Quartz Crystal; Note: PCB layout complies with manufacturer's recommendation.; Published: 17-Jul-2002; DatasheetDocument: 9-Sep-1999; PackageDocument: 9-Sep-1999; PackageReference: 2SMX; Publisher: Altium Limited; ComponentLink1Description: Manufacturer Link; ComponentLink1URL: http://www.cmac.com/mt/